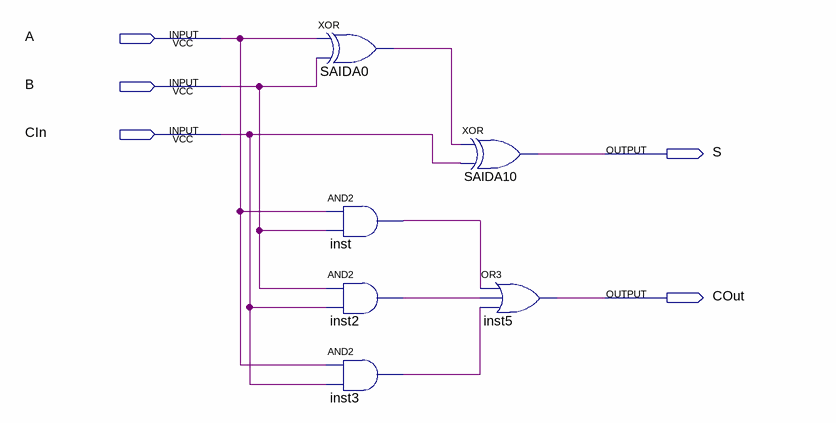
[diagram p0: schematic sheet]
// Quartus schematic somadorBit-a-Bit.bdf as structural Verilog: 6 symbols, 5 pins
module \somadorBit-a-Bit  (
  input  A,
  input  B,
  input  CIn,
  output S,
  output COut
);

  wire inst2_out, inst3_out, inst_out, SAIDA0_out;

  xor SAIDA0 (SAIDA0_out, A, B);
  and inst (inst_out, A, B);
  and inst2 (inst2_out, B, CIn);
  and inst3 (inst3_out, A, CIn);
  xor SAIDA10 (S, SAIDA0_out, CIn);
  or inst5 (COut, inst_out, inst2_out, inst3_out);
endmodule
